# Altium project WaterNet23BotPCB.PrjPcb
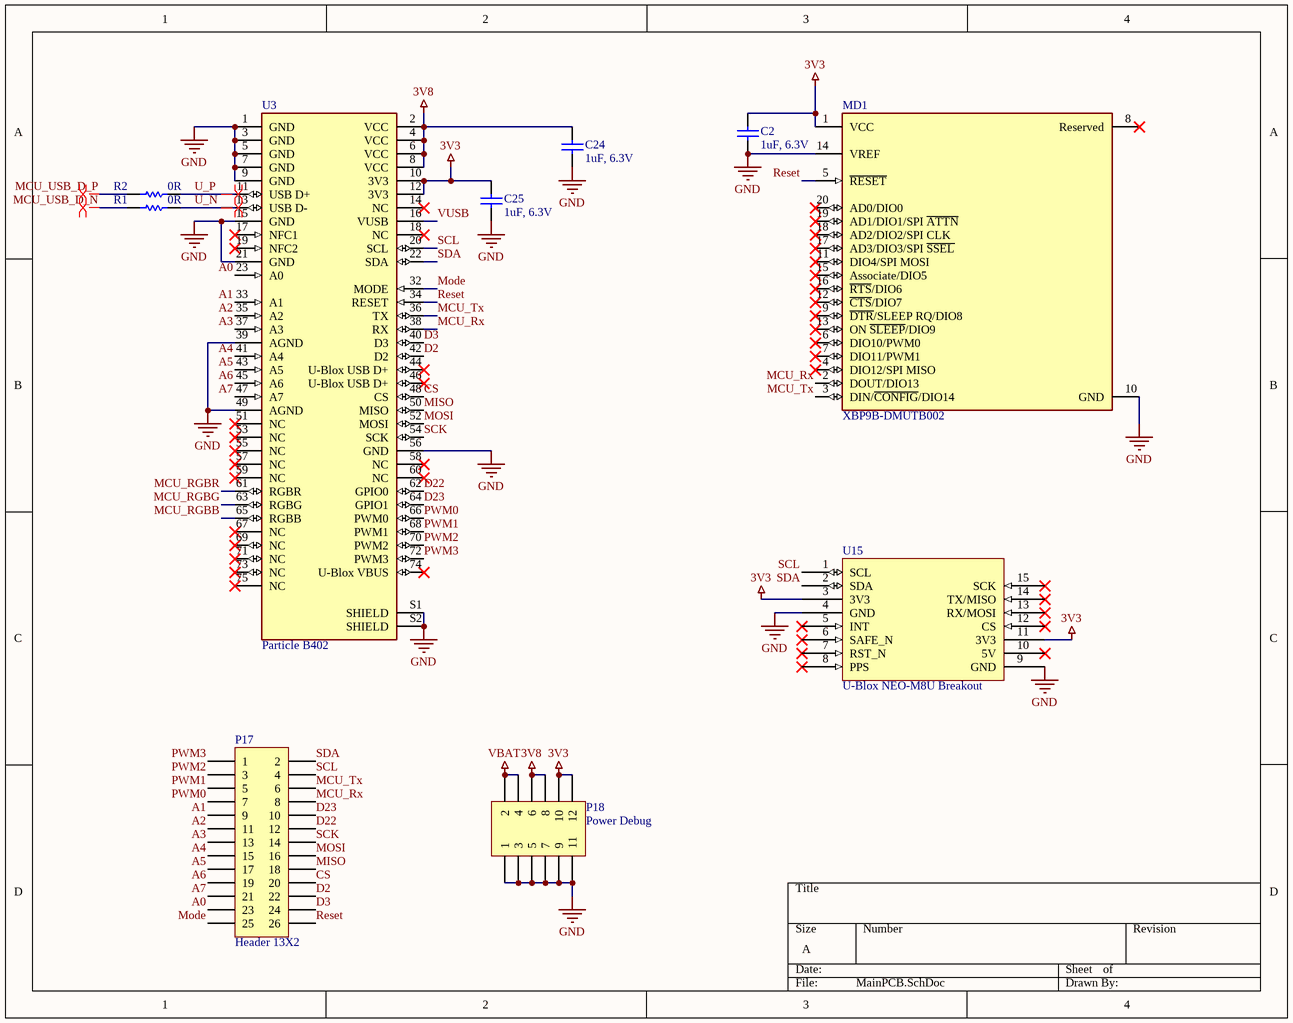
[diagram p0: MainPCB.SchDoc]
5 sheets, 153 parts. Net scope: global (net labels, ports and power ports of the same name join across sheets).
Board files: Main.PcbDoc, BetaPCB.PcbDoc
Sheets:
  MainPCB.SchDoc
  UserInputs.SchDoc
  Power.SchDoc
  LEDs.SchDoc
  Sensors.SchDoc

## Sheet MainPCB.SchDoc
size A; SheetNumber: 1; SheetTotal: 5

### Parts
C2  value 1uF, 6.3V  [ANTC1608X90N]  (hidden comment: Capacitor)
C24  value 1uF, 6.3V  [ANTC1608X90N]  (hidden comment: Capacitor)
C25  value 1uF, 6.3V  [ANTC1608X90N]  (hidden comment: Capacitor)
MD1  XBP9B-DMUTB002  [FP-XBP9B-DMUTB002-MFG]
P17  Header 13X2  [HDR2X13]
P18  Power Debug  [HDR2X6]
R1  value 0R  [0603 Resistor]  (hidden comment: Resistor)
R2  value 0R  [0603 Resistor]  (hidden comment: Resistor)
U3  Supplier Part Number 1: Particle B402  [B402 Full]  (hidden comment: B402)
U15  U-Blox NEO-M8U Breakout  [U-Blox NEO-M8U]

### Nets
3V3: C2.2 C25.2 MD1.1(VCC) P18.10 P18.12 U3.10(3V3) U3.12(3V3) U15.3(3V3) U15.11(3V3)
3V8: C24.2 P18.6 P18.8 U3.2(VCC) U3.4(VCC) U3.6(VCC) U3.8(VCC)
GND: C2.1 C24.1 C25.1 MD1.10(GND) MD1.14(VREF) P18.1 P18.3 P18.5 P18.7 P18.9 P18.11 U3.1(GND) U3.3(GND) U3.5(GND) U3.7(GND) U3.9(GND) U3.15(GND) U3.21(GND) U3.39(AGND) U3.49(AGND) U3.56(GND) U3.S1(SHIELD) U3.S2(SHIELD) U15.4(GND) U15.9(GND)
VBAT: P18.2 P18.4
A0: P17.23 U3.23(A0)
A1: P17.9 U3.33(A1)
A2: P17.11 U3.35(A2)
A3: P17.13 U3.37(A3)
A4: P17.15 U3.41(A4)
A5: P17.17 U3.43(A5)
A6: P17.19 U3.45(A6)
A7: P17.21 U3.47(A7)
CS: P17.20 U3.48(CS)
D2: P17.22 U3.42(D2)
D3: P17.24 U3.40(D3)
D22: P17.12 U3.62(GPIO0)
D23: P17.10 U3.64(GPIO1)
MCU_RGBB: U3.65(RGBB)
MCU_RGBG: U3.63(RGBG)
MCU_RGBR: U3.61(RGBR)
MCU_Rx: MD1.2(DOUT/DIO13) P17.8 U3.38(RX)
MCU_Tx: MD1.3(DIN/~{CONFIG}/DIO14) P17.6 U3.36(TX)
MCU_USB_D_N: R1.1
MCU_USB_D_P: R2.1
MISO: P17.18 U3.50(MISO)
Mode: P17.25 U3.32(MODE)
MOSI: P17.16 U3.52(MOSI)
PWM0: P17.7 U3.66(PWM0)
PWM1: P17.5 U3.68(PWM1)
PWM2: P17.3 U3.70(PWM2)
PWM3: P17.1 U3.72(PWM3)
Reset: MD1.5(~{RESET}) P17.26 U3.34(RESET)
SCK: P17.14 U3.54(SCK)
SCL: P17.4 U3.20(SCL) U15.1(SCL)
SDA: P17.2 U3.22(SDA) U15.2(SDA)
U_N: R1.2 U3.13(USB_D-)
U_P: R2.2 U3.11(USB_D+)
VUSB: U3.16(VUSB)

Not connected (* = marked no-connect by the designer): MD1 4(DIO12/SPI_MISO)* 6(DIO10/PWM0)* 7(DIO11/PWM1)* 8(Reserved)* 9(~{DTR}/SLEEP_RQ/DIO8)* 11(DIO4/SPI_MOSI)* 12(~{CTS}/DIO7)* 13(ON_~{SLEEP}/DIO9)* 15(Associate/DIO5)* 16(~{RTS}/DIO6)* 17(AD3/DIO3/SPI_~{SSEL})* 18(AD2/DIO2/SPI_CLK)* 19(AD1/DIO1/SPI_~{ATTN})* 20(AD0/DIO0)*; U3 14(NC)* 17(NFC1)* 18(NC)* 19(NFC2)* 44(U-Blox_USB_D+)* 46(U-Blox_USB_D+)* 51(NC)* 53(NC)* 55(NC)* 57(NC)* 58(NC)* 59(NC)* 60(NC)* 67(NC)* 69(NC)* 71(NC)* 73(NC)* 74(U-Blox_VBUS)* 75(NC)*; U15 5(INT)* 6(SAFE_N)* 7(RST_N)* 8(PPS)* 10(5V)* 12(CS)* 13(RX/MOSI)* 14(TX/MISO)* 15(SCK)*

### Layout directives
differential pair: MCU_USB_D_N, MCU_USB_D_P, U_N, U_P

### Library data of the parts
C2 C24 C25 = Capacitor: SimulationGenericComponent: True
MD1 = CMP-84319-000004-1: RX TXRX MOD ISM < 1GHZ U.FL TH; Max Supply Voltage: 3.6V; Current - Transmitting: 215mA; Sensitivity: -101dBm; Min Frequency: 902MHz; Memory Size: 2KB; Max Frequency: 928MHz; Min Supply Voltage: 2.4V; Current - Receiving: 29mA; Interface: SPI; Data Rate: 200Kbps; Frequency: 900MHz; Output Power (dBm): 24dBm; Number of Pins: 20; Series: XBee-Pro™; Max Operating Temperature: 85°C; Radiation Hardening: No; Min Operating Temperature: -40°C; Package Quantity: 1; RAM Size: 2KB; Packaging: Bulk; Case/Package: Module
P17 = Header 13X2: Header, 13-Pin, Dual row; LatestRevisionDate: 17-Jul-2002; LatestRevisionNote: Re-released for DXP Platform.; Publisher: Altium Limited
P18 = Header 6X2: Header, 6-Pin, Dual row; LatestRevisionDate: 17-Jul-2002; LatestRevisionNote: Re-released for DXP Platform.; Publisher: Altium Limited
R1 R2 = Resistor: TC1: 0; SimulationGenericComponent: True; TC2: 0
U3 = B402: Connector, Backplane, Housing, Receptacle, 67 Position, 2row; MP: 2199230-4; Package: None; Availability: Unavailable; Value: *; Price: None; Supplier 1: Digi-Key
U15 = U-Blox NEO-M8U Breakout: GPS Board

## Sheet UserInputs.SchDoc
size A; SheetNumber: 2; SheetTotal: 5
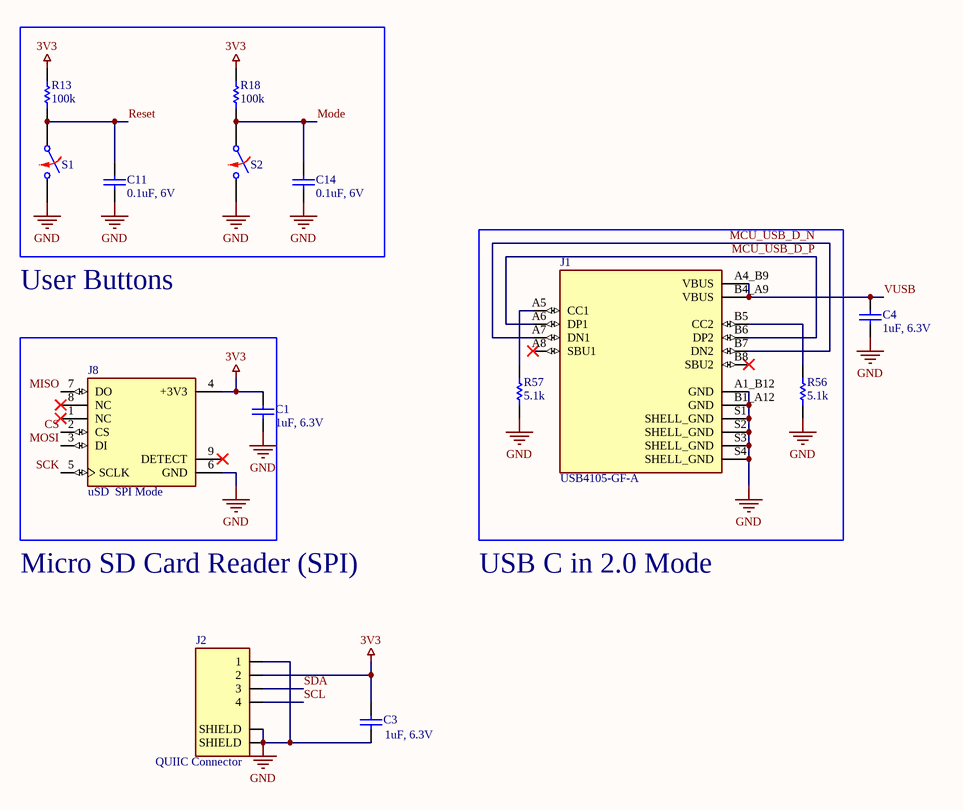
[diagram p1: UserInputs.SchDoc]

### Parts
C1  value 1uF, 6.3V  [ANTC1608X90N]  (hidden comment: Capacitor)
C3  value 1uF, 6.3V  [ANTC1608X90N]  (hidden comment: Capacitor)
C4  value 1uF, 6.3V  [ANTC1608X90N]  (hidden comment: Capacitor)
C11  value 0.1uF, 6V  [ANTC1608X90N]  (hidden comment: Capacitor)
C14  value 0.1uF, 6V  [ANTC1608X90N]  (hidden comment: Capacitor)
J1  USB4105-GF-A  [GCT_USB4105-GF-A]
J2  QUIIC Connector  [JST_SM04B-SRSS-TB(LF)(SN)]
J8  uSD  SPI Mode  [GCT_MEM2051-00-195-00-A]
R13  value 100k  [0603 Resistor]  (hidden comment: Resistor)
R18  value 100k  [0603 Resistor]  (hidden comment: Resistor)
R56  value 5.1k  [0603 Resistor]  (hidden comment: Resistor)
R57  value 5.1k  [0603 Resistor]  (hidden comment: Resistor)
S1  Switch Normally Opened  [TL3313AF250QG]  (value not drawn)
S2  Switch Normally Opened  [TL3313AF250QG]  (value not drawn)

### Nets
3V3: C1.2 C3.2 J2.2 J8.4(+3V3) R13.2 R18.2
GND: C1.1 C3.1 C4.1 C11.1 C14.1 J1.A1_B12(GND) J1.B1_A12(GND) J1.S1(SHELL_GND) J1.S2(SHELL_GND) J1.S3(SHELL_GND) J1.S4(SHELL_GND) J2.1 J2.S1(SHIELD) J2.S2(SHIELD) J8.6(GND) R56.1 R57.1 S1.2 S2.2
CS: J8.2(CS)
MCU_USB_D_N: J1.A7(DN1) J1.B7(DN2)
MCU_USB_D_P: J1.A6(DP1) J1.B6(DP2)
MISO: J8.7(DO)
Mode: C14.2 R18.1 S2.1
MOSI: J8.3(DI)
Reset: C11.2 R13.1 S1.1
SCK: J8.5(SCLK)
SCL: J2.4
SDA: J2.3
VUSB: C4.2 J1.A4_B9(VBUS) J1.B4_A9(VBUS)
NetJ1_A5: J1.A5(CC1) R57.2
NetJ1_B5: J1.B5(CC2) R56.2

Not connected (* = marked no-connect by the designer): J1 A8(SBU1)* B8(SBU2)*; J8 1(NC)* 8(NC)* 9(DETECT)*

### Notes on the sheet
- User Buttons
- Micro SD Card Reader (SPI)
- USB C in 2.0 Mode

### Library data of the parts
C1 C3 C4 C11 C14 = Capacitor: SimulationGenericComponent: True
J1 = USB4105-GF-A: USB-C (USB TYPE-C) USB 2.0 Receptacle Connector 24 (16+8 Dummy) Position Surface Mount, Right Angle; Through Hole; Value: *; Availability: Unavailable; Price: None; Package: None; MP: USB4105-GF-A
J2 = SM04B-SRSS-TB(LF)(SN): SH Series 1.0 mm Pitch 2 Position Single Row Side Entry Shrouded Header; Value: *; Availability: Unavailable; Price: None; Package: None; MP: SM04B-SRSS-TB(LF)(SN)
J8 = MEM2051-00-195-00-A: 9 (8 + 1) Position Card Connector microSDâ„¢ Surface Mount, Right Angle Gold, 1.95mm profile, Normally open switch, Push push, Top mount; MF: Global Connector Technology; Purchase-URL: https://pricing.snapeda.com/search/part/MEM2051-00-195-00-A/?ref=eda; Price: None; SnapEDA_Link: https://www.snapeda.com/parts/MEM2051-00-195-00-A/Global%20Connector%20Technology/view-part/779220/?ref=snap; Check_prices: https://www.snapeda.com/parts/MEM2051-00-195-00-A/Global%20Connector%20Technology/view-part/779220/?ref=eda; Package: None; MP: MEM2051-00-195-00-A; Value: *; Availability: Warning
R13 R18 R56 R57 = Resistor: TC1: 0; SimulationGenericComponent: True; TC2: 0
S1 S2 = SW NO: closed: 0; Rclosed: 1m; Ropen: 1Meg; SimulationGenericComponent: True

## Sheet Power.SchDoc
size 420 x 297 mm; SheetNumber: 3; SheetTotal: 5; SPICEModelCacheCTWGKBXG: <root> / <DocumentId>CTWGKBXG</DocumentId> / <CacheFrame Number="0"> / <Model Name="nmos" Kind="MDL"> / <Text>*Default N-Channel MOSFET / *Pinout: D,G,S / .MODEL NMOS NMOS()</Text> / </Model> / </CacheFrame> / </root>
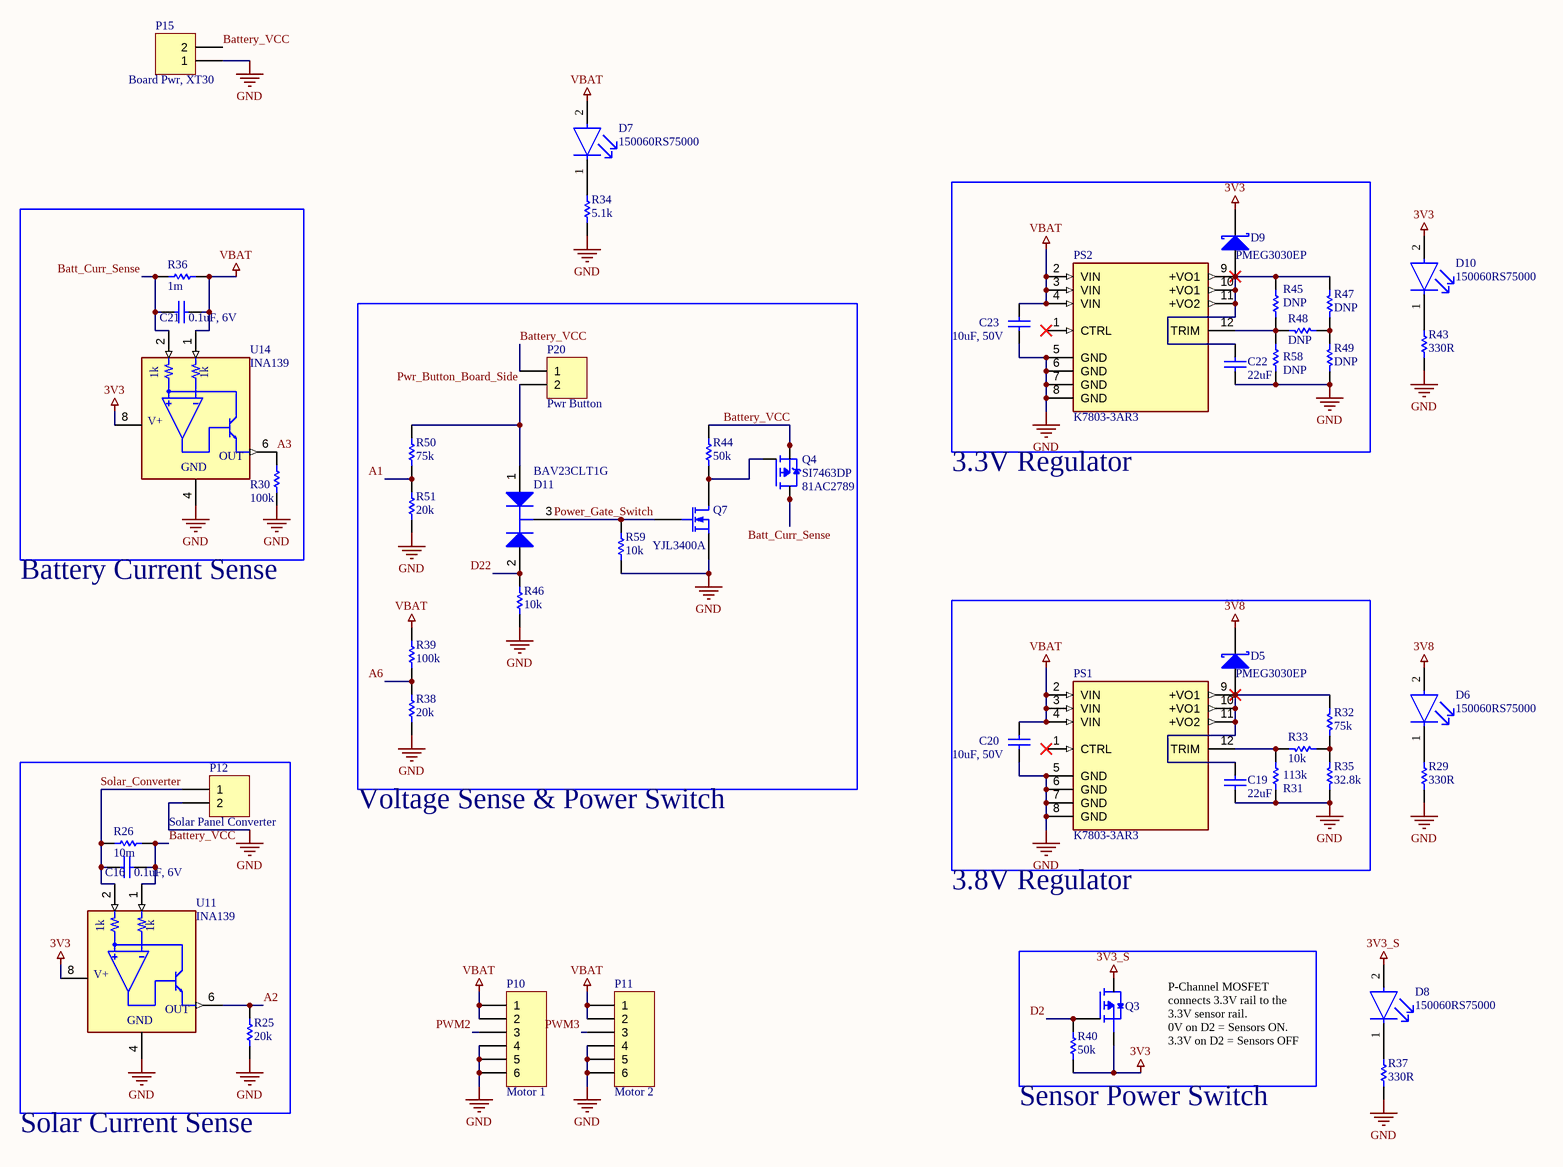
[diagram p2: Power.SchDoc]

### Parts
C16  value 0.1uF, 6V  [ANTC1608X90N]  (hidden comment: Capacitor)
C19  value 22uF  [ANTC1608X90N]  (hidden comment: Capacitor)
C20  value 10uF, 50V  [CAPC2012X145N]  (hidden comment: Capacitor)
C21  value 0.1uF, 6V  [ANTC1608X90N]  (hidden comment: Capacitor)
C22  value 22uF  [ANTC1608X90N]  (hidden comment: Capacitor)
C23  value 10uF, 50V  [CAPC2012X145N]  (hidden comment: Capacitor)
D5  PMEG3030EP  [SODFL470X110-2N]
D6  150060RS75000  [FP-150060RS75000-MFG]
D7  150060RS75000  [FP-150060RS75000-MFG]
D8  150060RS75000  [FP-150060RS75000-MFG]
D9  PMEG3030EP  [SODFL470X110-2N]
D10  150060RS75000  [FP-150060RS75000-MFG]
D11  BAV23CLT1G  [ONSC-SOT-23-3-318-08_V]
P10  Motor 1  [TE_1586039-6]
P11  Motor 2  [TE_1586039-6]
P12  Solar Panel Converter  [XT30_Horizontal]
P15  Board Pwr, XT30  [XT30_Horizontal]
P20  Pwr Button  [TE_6-440054-2]
PS1  K7803-3AR3  [CONV_K7803-3AR3]
PS2  K7803-3AR3  [CONV_K7803-3AR3]
Q3  YJL3415A  [SOT23-3]  (value not drawn)
Q4  SI7463DP  Supplier Part Number 1: 81AC2789  [SIR165DP]
Q7  YJL3400A  [SOT23-3]
R25  value 20k  [0603 Resistor]  (hidden comment: Resistor)
R26  value 10m  [RESC6331X70N]  (hidden comment: Resistor)
R29  value 330R  [0603 Resistor]  (hidden comment: Resistor)
R30  value 100k  [0603 Resistor]  (hidden comment: Resistor)
R31  value 113k  [0603 Resistor]  (hidden comment: Resistor)
R32  value 75k  [0603 Resistor]  (hidden comment: Resistor)
R33  value 10k  [0603 Resistor]  (hidden comment: Resistor)
R34  value 5.1k  [0603 Resistor]  (hidden comment: Resistor)
R35  value 32.8k  [0603 Resistor]  (hidden comment: Resistor)
R36  value 1m  [RESC6331X70N]  (hidden comment: Resistor)
R37  value 330R  [0603 Resistor]  (hidden comment: Resistor)
R38  value 20k  [0603 Resistor]  (hidden comment: Resistor)
R39  value 100k  [0603 Resistor]  (hidden comment: Resistor)
R40  value 50k  [0603 Resistor]  (hidden comment: Resistor)
R43  value 330R  [0603 Resistor]  (hidden comment: Resistor)
R44  value 50k  [0603 Resistor]  (hidden comment: Resistor)
R45  value DNP  [0603 Resistor]  (hidden comment: Resistor)
R46  value 10k  [0603 Resistor]  (hidden comment: Resistor)
R47  value DNP  [0603 Resistor]  (hidden comment: Resistor)
R48  value DNP  [0603 Resistor]  (hidden comment: Resistor)
R49  value DNP  [0603 Resistor]  (hidden comment: Resistor)
R50  value 75k  [0603 Resistor]  (hidden comment: Resistor)
R51  value 20k  [0603 Resistor]  (hidden comment: Resistor)
R58  value DNP  [0603 Resistor]  (hidden comment: Resistor)
R59  value 10k  [0603 Resistor]  (hidden comment: Resistor)
U11  INA139  [INA139-Q1]
U14  INA139  [INA139-Q1]

### Nets
3V3: D9.2(K) D10.2(A) Q3.3(D) R40.1 U11.8(V+) U14.8(V+)
3V3_S: D8.2(A) Q3.2(S)
3V8: D5.2(K) D6.2(A)
GND: C19.1 C20.1 C22.1 C23.1 P10.4 P10.5 P10.6 P11.4 P11.5 P11.6 P12.2 P15.1 PS1.5(GND) PS1.6(GND) PS1.7(GND) PS1.8(GND) PS2.5(GND) PS2.6(GND) PS2.7(GND) PS2.8(GND) Q7.2(S) R25.1 R29.2 R30.1 R31.1 R34.2 R35.1 R37.2 R38.1 R43.2 R46.1 R49.1 R51.1 R58.1 R59.1 U11.4(GND) U14.4(GND)
VBAT: C20.2 C21.1 C23.2 D7.2(A) P10.1 P10.2 P11.1 P11.2 PS1.2(VIN) PS1.3(VIN) PS1.4(VIN) PS2.2(VIN) PS2.3(VIN) PS2.4(VIN) R36.1 R39.2 U14.1(VIN-)
A1: R50.1 R51.2
A2: R25.2 U11.6(OUT)
A3: R30.2 U14.6(OUT)
A6: R38.2 R39.1
Batt_Curr_Sense: C21.2 Q4.5(D) Q4.6(D) Q4.7(D) Q4.8(D) Q4.9(D) R36.2 U14.2(VIN+)
Battery_VCC: C16.1 P15.2 P20.1 Q4.1(S) Q4.2(S) Q4.3(S) R26.2 R44.2 U11.1(VIN-)
D2: Q3.1(G) R40.2
D22: D11.2(A2) R46.2
Power_Gate_Switch: D11.3(K) Q7.1(G) R59.2
PWM2: P10.3
PWM3: P11.3
Pwr_Button_Board_Side: D11.1(A1) P20.2 R50.2
Solar_Converter: C16.2 P12.1 R26.1 U11.2(VIN+)
NetC19_2: C19.2 D5.1(A) PS1.9(+VO1) PS1.10(+VO1) PS1.11(+VO2) R32.2
NetC22_2: C22.2 D9.1(A) PS2.9(+VO1) PS2.10(+VO1) PS2.11(+VO2) R45.2 R47.2
NetD6_1: D6.1(C) R29.1
NetD7_1: D7.1(C) R34.1
NetD8_1: D8.1(C) R37.1
NetD10_1: D10.1(C) R43.1
NetPS1_12: PS1.12(TRIM) R31.2 R33.1
NetPS2_12: PS2.12(TRIM) R45.1 R48.1 R58.2
NetQ4_4: Q4.4(G) Q7.3(D) R44.1
NetR32_1: R32.1 R33.2 R35.2
NetR47_1: R47.1 R48.2 R49.2

Not connected (* = marked no-connect by the designer): PS1 1(CTRL)*; PS2 1(CTRL)*

### Notes on the sheet
- (near PS2) 3.3V Regulator
- Battery Current Sense
- Voltage Sense & Power Switch
- (near PS1) 3.8V Regulator
- P-Channel MOSFET connects 3.3V rail to the 3.3V sensor rail.               0V on D2 = Sensors ON.                             3.3V on D2 = Sensors OFF
- (near R40) Sensor Power Switch
- Solar Current Sense
- THIS DOCUMENT AND THE DATA DISCLOSED HEREIN OR
- HEREWITH IS THE PROPERTY OF ALTIUM LIMITED AND MAY
- DWG NO:
- REVISION
- REV:
- DESCRIPTION
- DATE
- APPROVED
- BE FREELY DISTRIBUTED IN WHOLE. NO RIGHTS ARE
- RESERVED OR EXPRESS OR IMPLIED WARANTEE GIVEN.
- ENG:
- APPROVALS
- PROJECT
- DSN:
- CHK:
- REFERENCE DOCUMENTS
- PROJECT REVISION:
- TITLE
- DOCUMENT REVISION:
- DESIGN ITEM:
- BOM:
- FAB DWG:
- PCB DWG:
- ASSY DWG:
- SCALE:
- A3
- SIZE
- CAGE CODE
- FILE NAME
- DWG NO.
- SHEET
- OF
- REV
- (in symbol INA139) 1k

### Library data of the parts
C16 C19-C23 = Capacitor: SimulationGenericComponent: True
D5 D9 = Shottky Diode: AF: 1; BV: 0; BV_MAX: 1e99; EG: 1.11; FC: 0.5; IBV: 0.001; IS: 1e-14; MJSW: 0.33; NTUN: 30; TNOM: 27; XTI: 3; SimulationGenericComponent: True; CJO: 0; CJP: 0; CTA: 0; CTP: 0; FCS: 0.5; FV_MAX: 1e99; IKF: 0; IKR: 0; ISR: 1e-14; JSW: 0; JTUN: 0; JTUNSW: 0; KEG: 1; KF: 0; LEVEL: 1; N: 1; NBV: 1; NR: 1; NS: 1; PHP: 1; RS: 0; TCV: 0; TLEV: 0; TLEVC: 0; TM1: 0; TM2: 0; TPB: 0; TPHP: 0; TRS: 0; TRS2: 0; TT: 0; TTT1: 0; TTT2: 0; VJ: 1; XTITUN: 3
D6-D8 D10 = CMP-1426-00001-2: LED RED CLEAR 0603 SMD; Luminous Intensity: 250mcd; Viewing Angle: 140°; Dominant Wavelength: 625nm; Test Current: 20mA; Forward Current: 30mA; Forward Voltage: 2V; Lens Color: Colorless; Lens Size: 0.7mm; Width: 0.8mm; Series: WL-SMCW; Color: Red; Min Operating Temperature: -40°C; RoHS Compliant: Yes; Height: 0.8mm; Package Quantity: 1; Packaging: Cut Tape; Mount: Surface Mount; Case/Package: 0603; Lens Transparency: Clear; Length: 1.6mm; Case Code (Imperial): 0603; Lens Style: Clear; Wavelength: 625nm; Max Operating Temperature: 85°C; Case Code (Metric): 1608
D11 = CMP-1054-00102-1: Dual High Voltage Common Cathode Switching Diodes, 3-Pin SOT-23, Pb-Free, Tape and Reel; Manufacturer: On Semiconductor; IF Max (A): 0.4; trr Max (ns): 150; ComponentLink1Description: Manufacturer URL; ComponentLink2URL: http://www.onsemi.com/pub_link/Collateral/BAV23CLT1-D.PDF; Packing: Tape and Reel; PackageReference: SOT-23-3-318-08; Configuration: Common Cathode; Mounting Technology: Surface Mount; DatasheetVersion: Rev. 2; ComponentLink3Description: Package Specification; PartNumber: BAV23CLT1G; ComponentLink1URL: http://www.onsemi.com/; PackageDescription: 3-Pin Small Outline Transistor, Body 2.92 x 1.3 mm, Pitch 0.95 mm; RoHS: TRUE; ComponentLink3URL: http://www.onsemi.cn/pub_link/Collateral/318-08.PDF; PackageVersion: Rev. AP, 11/2009; ComponentLink2Description: Datasheet
P10 P11 = Header 6: Header, 6-Pin; LatestRevisionDate: 17-Jul-2002; LatestRevisionNote: Re-released for DXP Platform.; Publisher: Altium Limited
P12 P15 P20 = Header 2: Header, 2-Pin; LatestRevisionDate: 17-Jul-2002; LatestRevisionNote: Re-released for DXP Platform.; Publisher: Altium Limited
PS1 PS2 = K7803-3AR3: Non-Isolated PoL Module DC DC Converter 1 Output 3.3V - - - 3A 8V - 36V Input; MF: Mornsun America, LLC; MP: K7803-3AR3; Purchase-URL: https://pricing.snapeda.com/search/part/K7803-3AR3/?ref=eda; SnapEDA_Link: https://www.snapeda.com/parts/K7803-3AR3/MORNSUN/view-part/?ref=snap; Check_prices: https://www.snapeda.com/parts/K7803-3AR3/MORNSUN/view-part/?ref=eda; Digi-Key_Part_Number: 2725-K7803-3AR3-ND; Package: SIP-12-12 MORNSUN; Value: *
Q3 = YJL3415A: P-Channel MOSFET
Q4 = SI7463DP: MOSFET P-CH 30V 60A PPAK SO-8; MF: Vishay; Check_prices: https://www.snapeda.com/parts/SI7463DP/Vishay/view-part/2773444/?ref=eda; Value: *; Purchase-URL: https://pricing.snapeda.com/search/part/SI7463DP/?ref=eda; Package: SO-8 Vishay; Price: None; MP: SI7463DP; Availability: In Stock; SnapEDA_Link: https://www.snapeda.com/parts/SI7463DP/Vishay/view-part/2773444/?ref=snap; Supplier 1: Newark
Q7 = MOSFET-N: N-Channel MOSFET; Published: 8-Jun-2000; LatestRevisionDate: 17-Jul-2002; LatestRevisionNote: Re-released for DXP Platform.; PackageVersion: 1995/1996; PackageReference: E3; Publisher: Altium Limited; PackageDescription: TO, Flat Index; 3 In-Line, Axial Leads; Body Dia. 4.6mm; Lead Dia. 0.5 mm (max)
R25 R26 R29-R40 R43-R51 R58 R59 = Resistor: TC1: 0; SimulationGenericComponent: True; TC2: 0
U11 U14 = INA139: Current Monitor Regulator High-Side SOT-23-5; MF: Texas Instruments; Package: SOT-23-5 Texas Instruments; Value: *; Availability: Unavailable; MP: INA139; SnapEDA_Link: https://www.snapeda.com/parts/INA139/Texas%20Instruments/view-part/560986/?ref=snap; Price: None

## Sheet LEDs.SchDoc
size A; SheetNumber: 4; SheetTotal: 5
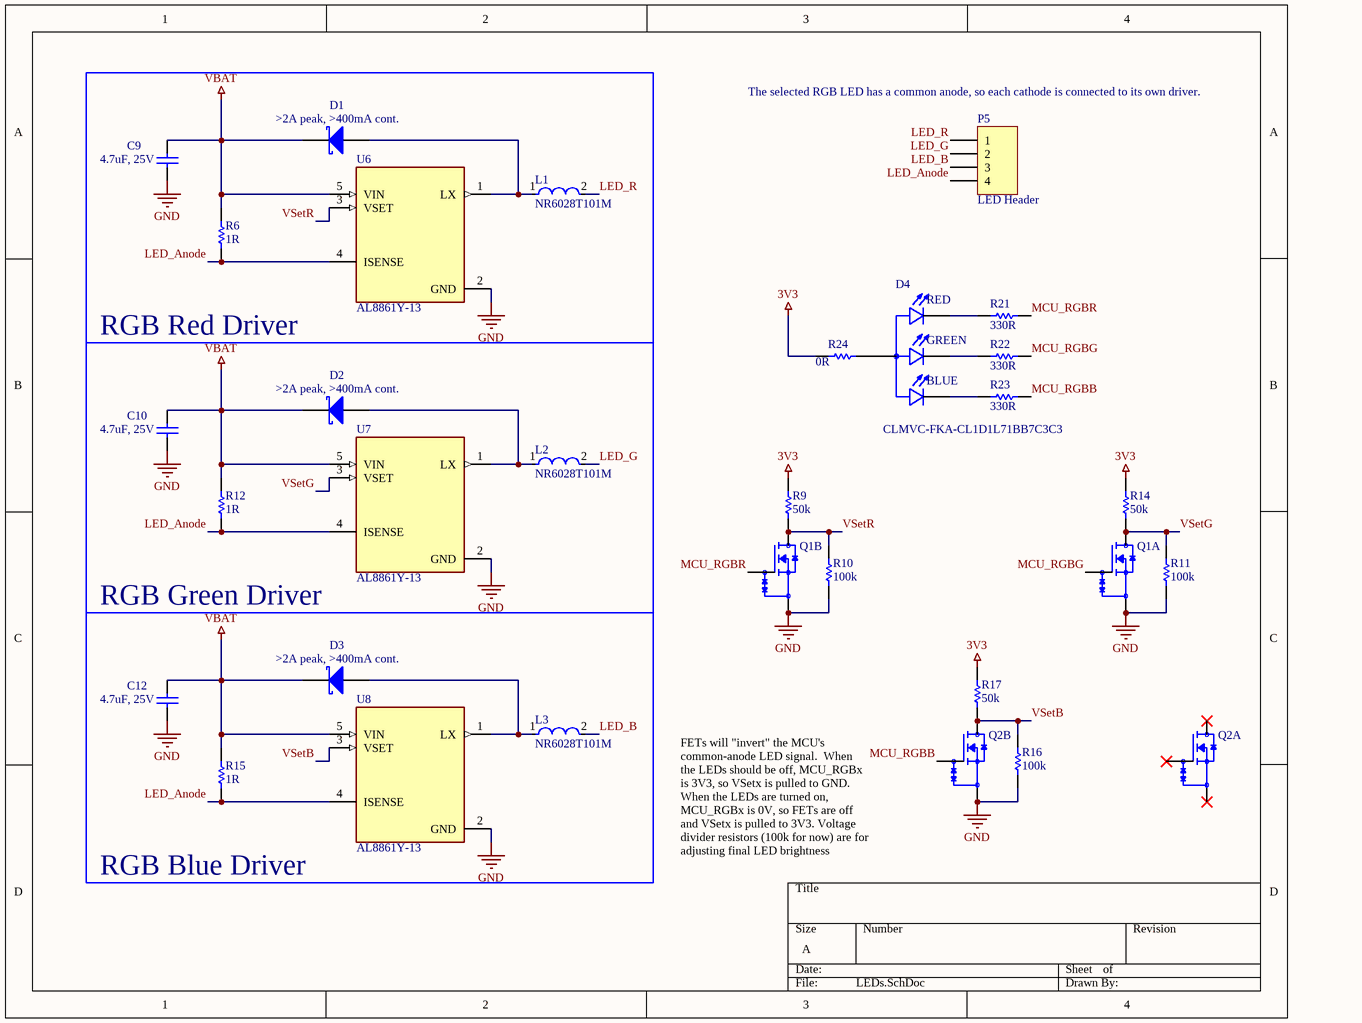
[diagram p3: LEDs.SchDoc]

### Parts
C9  value 4.7uF, 25V  [ANTC1608X90N]  (hidden comment: Capacitor)
C10  value 4.7uF, 25V  [ANTC1608X90N]  (hidden comment: Capacitor)
C12  value 4.7uF, 25V  [ANTC1608X90N]  (hidden comment: Capacitor)
D1  >2A peak, >400mA cont.  [DIO_SS26FL]
D2  >2A peak, >400mA cont.  [DIO_SS26FL]
D3  >2A peak, >400mA cont.  [DIO_SS26FL]
D4  CLMVC-FKA-CL1D1L71BB7C3C3  [LED_CLMVC-FKA-CL1D1L71BB7C3C3]
L1  NR6028T101M  [FP-NR6028-MFG]
L2  NR6028T101M  [FP-NR6028-MFG]
L3  NR6028T101M  [FP-NR6028-MFG]
P5  LED Header  [TE_350761-4]
Q1  TSM2N7002KDCU6_RFG  [SOT65P210X110-6N]  (value not drawn)  (parts A,B of 2)
Q2  TSM2N7002KDCU6_RFG  [SOT65P210X110-6N]  (value not drawn)  (parts A,B of 2)
R6  value 1R  [0603 Resistor]  (hidden comment: Resistor)
R9  value 50k  [0603 Resistor]  (hidden comment: Resistor)
R10  value 100k  [0603 Resistor]  (hidden comment: Resistor)
R11  value 100k  [0603 Resistor]  (hidden comment: Resistor)
R12  value 1R  [0603 Resistor]  (hidden comment: Resistor)
R14  value 50k  [0603 Resistor]  (hidden comment: Resistor)
R15  value 1R  [0603 Resistor]  (hidden comment: Resistor)
R16  value 100k  [0603 Resistor]  (hidden comment: Resistor)
R17  value 50k  [0603 Resistor]  (hidden comment: Resistor)
R21  value 330R  [0603 Resistor]  (hidden comment: Resistor)
R22  value 330R  [0603 Resistor]  (hidden comment: Resistor)
R23  value 330R  [0603 Resistor]  (hidden comment: Resistor)
R24  value 0R  [0603 Resistor]  (hidden comment: Resistor)
U6  AL8861Y-13  [CONV_AL8861Y-13]
U7  AL8861Y-13  [CONV_AL8861Y-13]
U8  AL8861Y-13  [CONV_AL8861Y-13]

### Blocks framed on the sheet
RGB Red Driver: C9 D1 L1 R6 U6
RGB Green Driver: C10 D2 L2 R12 U7
RGB Blue Driver: C12 D3 L3 R15 U8

### Nets
3V3: R9.2 R14.2 R17.2 R24.1
GND: C9.1 C10.1 C12.1 Q1.1(S1) Q1.4(S2) Q2.4(S2) R10.1 R11.1 R16.1 U6.2(GND) U7.2(GND) U8.2(GND)
VBAT: C9.2 C10.2 C12.2 D1.2(K) D2.2(K) D3.2(K) R6.1 R12.1 R15.1 U6.5(VIN) U7.5(VIN) U8.5(VIN)
LED_Anode: P5.4 R6.2 R12.2 R15.2 U6.4(ISENSE) U7.4(ISENSE) U8.4(ISENSE)
LED_B: L3.2 P5.3
LED_G: L2.2 P5.2
LED_R: L1.2 P5.1
MCU_RGBB: Q2.5(G2) R23.2
MCU_RGBG: Q1.2(G1) R22.2
MCU_RGBR: Q1.5(G2) R21.2
VSetB: Q2.3(D2) R16.2 R17.1 U8.3(VSET)
VSetG: Q1.6(D1) R11.2 R14.1 U7.3(VSET)
VSetR: Q1.3(D2) R9.1 R10.2 U6.3(VSET)
NetD1_1: D1.1(A) L1.1 U6.1(LX)
NetD2_1: D2.1(A) L2.1 U7.1(LX)
NetD3_1: D3.1(A) L3.1 U8.1(LX)
NetD4_1: D4.1(A) R24.2
NetD4_2: D4.2(B_C) R23.1
NetD4_3: D4.3(G_C) R22.1
NetD4_4: D4.4(R_C) R21.1

Not connected (* = marked no-connect by the designer): Q2 1(S1)* 2(G1)* 6(D1)*

### Notes on the sheet
- (near P5) The selected RGB LED has a common anode, so each cathode is connected to its own driver.
- FETs will "invert" the MCU's common-anode LED signal.  When the LEDs should be off, MCU_RGBx is 3V3, so VSetx is pulled to GND.  When the LEDs are turned on, MCU_RGBx is 0V, so FETs are off and VSetx is pulled to 3V3. Voltage divider resistors (100k for now) are for adjusting final LED brightness
- (in symbol CLMVC-FKA-CL1D1L71BB7C3C3) RED; GREEN; BLUE

### Library data of the parts
C9 C10 C12 = Capacitor: SimulationGenericComponent: True
D1-D3 = Shottky Diode: as D5 on sheet Power; CJO: 0; CJP: 0; CTA: 0; CTP: 0; FCS: 0.5; FV_MAX: 1e99; IKF: 0; IKR: 0; ISR: 1e-14; JSW: 0; JTUN: 0; JTUNSW: 0; KEG: 1; KF: 0; LEVEL: 1; N: 1; NBV: 1; NR: 1; NS: 1; PHP: 1; RS: 0; TCV: 0; TLEV: 0; TLEVC: 0; TM1: 0; TM2: 0; TPB: 0; TPHP: 0; TRS: 0; TRS2: 0; TT: 0; TTT1: 0; TTT2: 0; VJ: 1; XTITUN: 3
D4 = CLMVC-FKA-CL1D1L71BB7C3C3: Red, Green, Blue (RGB) 622nm Red, 530nm Green, 470nm Blue LED Indication - Discrete 2V Red, 3V Green, 3V Blue 4-SMD, J-Lead; MF: Cree Inc.; SnapEDA_Link: https://www.snapeda.com/parts/CLMVC-FKA-CL1D1L71BB7C3C3/Cree%20Inc./view-part/3120624/?ref=snap; Package: SMD-4 Cree Inc.; Check_prices: https://www.snapeda.com/parts/CLMVC-FKA-CL1D1L71BB7C3C3/Cree%20Inc./view-part/3120624/?ref=eda; MP: CLMVC-FKA-CL1D1L71BB7C3C3; Value: *; Purchase-URL: https://pricing.snapeda.com/search/part/CLMVC-FKA-CL1D1L71BB7C3C3/?ref=eda; Availability: Warning; Price: None
L1-L3 = CMP-14484-001005-1: SMD Power Inductors 100uH ±20% 0.62A 0.78Ω; Self Resonant Frequency: 3MHz; RMS Current (Irms): 660mA; Shielding: Shielded; Core Material: Ferrite; Test Frequency: 100kHz; DC Resistance (DCR): 780mR; Saturation Current: 620mA; Max Operating Temperature: 120°C; Halogen Free: Halogen Free; Tolerance: 20%; Number of Pins: 2; Resistor Type: Wirewound; Length: 0.236inch; Mount: Surface Mount; Case/Package: Nonstandard; RoHS Compliant: Yes; Inductance Tolerance: 20%; Lead Free: Lead Free; Max DC Current: 660mA; Height - Seated (Max): 0.11inch; Current Rating: 660mA; Packaging: Tape and Reel; Min Operating Temperature: -25°C; Inductance: 100uH; Termination: SMD/SMT; Height: 2.8mm; Package Quantity: 2000; Series: NR; Width: 0.236inch
P5 = Header 4: Header, 4-Pin; LatestRevisionDate: 17-Jul-2002; LatestRevisionNote: Re-released for DXP Platform.; Publisher: Altium Limited
Q1 Q2 = TSM2N7002KDCU6_RFG: 60V, 0.22A, Dual N-Channel Power MOSFET; MF: Taiwan Semiconductor; MP: TSM2N7002KDCU6 RFG; Value: *; Check_prices: https://www.snapeda.com/parts/TSM2N7002KDCU6%20RFG/Taiwan+Semiconductor/view-part/?ref=eda; Price: None; SnapEDA_Link: https://www.snapeda.com/parts/TSM2N7002KDCU6%20RFG/Taiwan+Semiconductor/view-part/?ref=snap; Availability: In Stock; Package: None
R6 R9-R12 R14-R17 R21-R24 = Resistor: TC1: 0; SimulationGenericComponent: True; TC2: 0
U6-U8 = AL8861Y-13: LED Driver IC 1 Output DC DC Regulator Step-Down _Buck_ Analog, PWM Dimming 1.5A SOT-89-5; MF: Diodes Inc.; Availability: Unavailable; SnapEDA_Link: https://www.snapeda.com/parts/AL8861Y-13/Diodes%20Inc./view-part/1241445/?ref=snap; MP: AL8861Y-13; Price: None; Package: SOT-89 Diodes Inc.; Value: *

## Sheet Sensors.SchDoc
size 431 x 279 mm; SheetNumber: 5; SheetTotal: 5; SPICEModelCacheYBELZEHK: <root> / <DocumentId>YBELZEHK</DocumentId> / <CacheFrame Number="0"> / <Model Name="nmos" Kind="MDL"> / <Text>*Default N-Channel MOSFET / *Pinout: D,G,S / .MODEL NMOS NMOS()</Text> / </Model> / </CacheFrame> / </root>
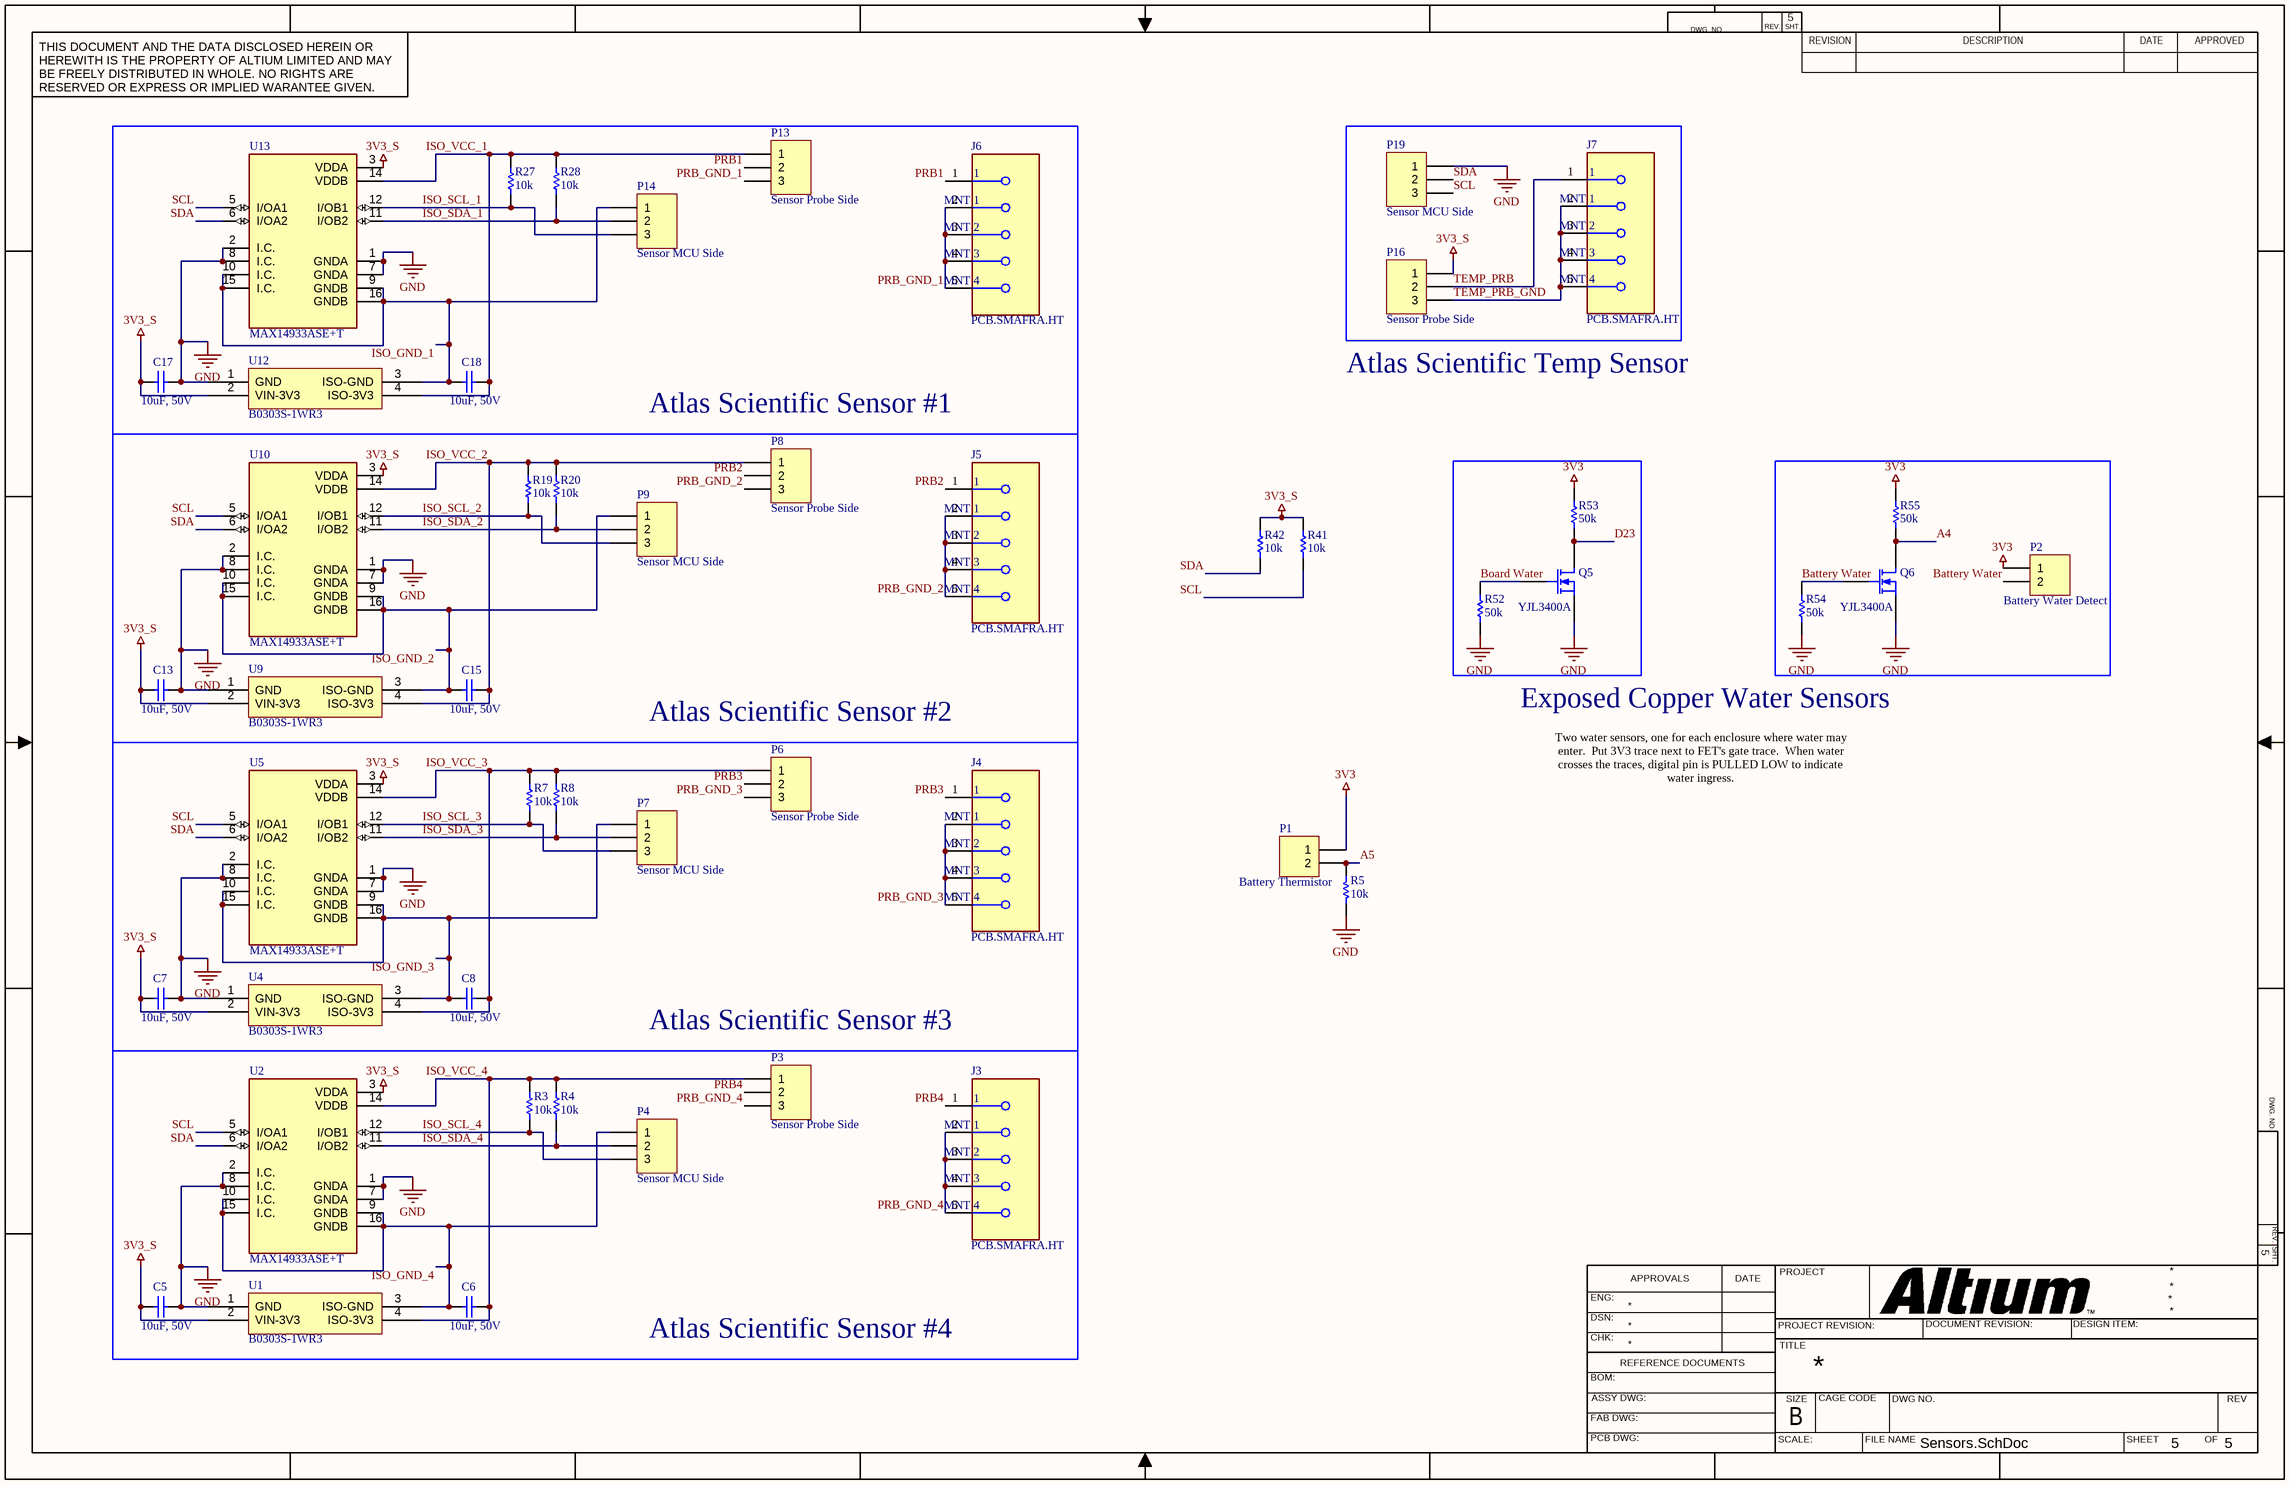
[diagram p4: Sensors.SchDoc]

### Parts
C5  value 10uF, 50V  [CAPC2012X145N]  (hidden comment: Capacitor)
C6  value 10uF, 50V  [CAPC2012X145N]  (hidden comment: Capacitor)
C7  value 10uF, 50V  [CAPC2012X145N]  (hidden comment: Capacitor)
C8  value 10uF, 50V  [CAPC2012X145N]  (hidden comment: Capacitor)
C13  value 10uF, 50V  [CAPC2012X145N]  (hidden comment: Capacitor)
C15  value 10uF, 50V  [CAPC2012X145N]  (hidden comment: Capacitor)
C17  value 10uF, 50V  [CAPC2012X145N]  (hidden comment: Capacitor)
C18  value 10uF, 50V  [CAPC2012X145N]  (hidden comment: Capacitor)
J3  PCB.SMAFRA.HT  [FP-PCB_SMAFRA_HT-MFG]
J4  PCB.SMAFRA.HT  [FP-PCB_SMAFRA_HT-MFG]
J5  PCB.SMAFRA.HT  [FP-PCB_SMAFRA_HT-MFG]
J6  PCB.SMAFRA.HT  [FP-PCB_SMAFRA_HT-MFG]
J7  PCB.SMAFRA.HT  [FP-PCB_SMAFRA_HT-MFG]
P1  Battery Thermistor  [TE_6-440054-2]
P2  Battery Water Detect  [TE_6-440054-2]
P3  Sensor Probe Side  [1x3 Header]
P4  Sensor MCU Side  [1x3 Header]
P6  Sensor Probe Side  [1x3 Header]
P7  Sensor MCU Side  [1x3 Header]
P8  Sensor Probe Side  [1x3 Header]
P9  Sensor MCU Side  [1x3 Header]
P13  Sensor Probe Side  [1x3 Header]
P14  Sensor MCU Side  [1x3 Header]
P16  Sensor Probe Side  [1x3 Header]
P19  Sensor MCU Side  [1x3 Header]
Q5  YJL3400A  [SOT23-3]
Q6  YJL3400A  [SOT23-3]
R3  value 10k  [0603 Resistor]  (hidden comment: Resistor)
R4  value 10k  [0603 Resistor]  (hidden comment: Resistor)
R5  value 10k  [0603 Resistor]  (hidden comment: Resistor)
R7  value 10k  [0603 Resistor]  (hidden comment: Resistor)
R8  value 10k  [0603 Resistor]  (hidden comment: Resistor)
R19  value 10k  [0603 Resistor]  (hidden comment: Resistor)
R20  value 10k  [0603 Resistor]  (hidden comment: Resistor)
R27  value 10k  [0603 Resistor]  (hidden comment: Resistor)
R28  value 10k  [0603 Resistor]  (hidden comment: Resistor)
R41  value 10k  [0603 Resistor]  (hidden comment: Resistor)
R42  value 10k  [0603 Resistor]  (hidden comment: Resistor)
R52  value 50k  [0603 Resistor]  (hidden comment: Resistor)
R53  value 50k  [0603 Resistor]  (hidden comment: Resistor)
R54  value 50k  [0603 Resistor]  (hidden comment: Resistor)
R55  value 50k  [0603 Resistor]  (hidden comment: Resistor)
U1  B0303S-1WR3  [B0303S-1WR3]
U2  MAX14933ASE+T  [SOIC127P600X175-16N]
U4  B0303S-1WR3  [B0303S-1WR3]
U5  MAX14933ASE+T  [SOIC127P600X175-16N]
U9  B0303S-1WR3  [B0303S-1WR3]
U10  MAX14933ASE+T  [SOIC127P600X175-16N]
U12  B0303S-1WR3  [B0303S-1WR3]
U13  MAX14933ASE+T  [SOIC127P600X175-16N]

### Blocks framed on the sheet
Atlas Scientific Sensor #1: C17 C18 J6 P13 P14 R27 R28 U12 U13
Atlas Scientific Sensor #2: C13 C15 J5 P8 P9 R19 R20 U9 U10
Atlas Scientific Sensor #3: C7 C8 J4 P6 P7 R7 R8 U4 U5
Atlas Scientific Sensor #4: C5 C6 J3 P3 P4 R3 R4 U1 U2

### Nets
3V3: P1.1 P2.1 R53.2 R55.2
3V3_S: C5.1 C7.1 C13.1 C17.1 P16.1 R41.2 R42.2 U1.2(VIN-3V3) U2.3(VDDA) U4.2(VIN-3V3) U5.3(VDDA) U9.2(VIN-3V3) U10.3(VDDA) U12.2(VIN-3V3) U13.3(VDDA)
GND: C5.2 C7.2 C13.2 C17.2 P19.1 Q5.2(S) Q6.2(S) R5.1 R52.1 R54.1 U1.1(GND) U2.1(GNDA) U2.2(I.C.) U2.7(GNDA) U2.8(I.C.) U4.1(GND) U5.1(GNDA) U5.2(I.C.) U5.7(GNDA) U5.8(I.C.) U9.1(GND) U10.1(GNDA) U10.2(I.C.) U10.7(GNDA) U10.8(I.C.) U12.1(GND) U13.1(GNDA) U13.2(I.C.) U13.7(GNDA) U13.8(I.C.)
A4: Q6.3(D) R55.1
A5: P1.2 R5.2
Battery Water: P2.2 Q6.1(G) R54.2
Board Water: Q5.1(G) R52.2
D23: Q5.3(D) R53.1
ISO_GND_1: C18.1 P14.1 U12.3(ISO-GND) U13.9(GNDB) U13.10(I.C.) U13.15(I.C.) U13.16(GNDB)
ISO_GND_2: C15.1 P9.1 U9.3(ISO-GND) U10.9(GNDB) U10.10(I.C.) U10.15(I.C.) U10.16(GNDB)
ISO_GND_3: C8.1 P7.1 U4.3(ISO-GND) U5.9(GNDB) U5.10(I.C.) U5.15(I.C.) U5.16(GNDB)
ISO_GND_4: C6.1 P4.1 U1.3(ISO-GND) U2.9(GNDB) U2.10(I.C.) U2.15(I.C.) U2.16(GNDB)
ISO_SCL_1: P14.3 R27.1 U13.12(I/OB1)
ISO_SCL_2: P9.3 R19.1 U10.12(I/OB1)
ISO_SCL_3: P7.3 R7.1 U5.12(I/OB1)
ISO_SCL_4: P4.3 R3.1 U2.12(I/OB1)
ISO_SDA_1: P14.2 R28.1 U13.11(I/OB2)
ISO_SDA_2: P9.2 R20.1 U10.11(I/OB2)
ISO_SDA_3: P7.2 R8.1 U5.11(I/OB2)
ISO_SDA_4: P4.2 R4.1 U2.11(I/OB2)
ISO_VCC_1: C18.2 P13.1 R27.2 R28.2 U12.4(ISO-3V3) U13.14(VDDB)
ISO_VCC_2: C15.2 P8.1 R19.2 R20.2 U9.4(ISO-3V3) U10.14(VDDB)
ISO_VCC_3: C8.2 P6.1 R7.2 R8.2 U4.4(ISO-3V3) U5.14(VDDB)
ISO_VCC_4: C6.2 P3.1 R3.2 R4.2 U1.4(ISO-3V3) U2.14(VDDB)
PRB1: J6.1 P13.2
PRB2: J5.1 P8.2
PRB3: J4.1 P6.2
PRB4: J3.1 P3.2
PRB_GND_1: J6.2(MNT_1) J6.3(MNT_2) J6.4(MNT_3) J6.5(MNT_4) P13.3
PRB_GND_2: J5.2(MNT_1) J5.3(MNT_2) J5.4(MNT_3) J5.5(MNT_4) P8.3
PRB_GND_3: J4.2(MNT_1) J4.3(MNT_2) J4.4(MNT_3) J4.5(MNT_4) P6.3
PRB_GND_4: J3.2(MNT_1) J3.3(MNT_2) J3.4(MNT_3) J3.5(MNT_4) P3.3
SCL: P19.3 R41.1 U2.5(I/OA1) U5.5(I/OA1) U10.5(I/OA1) U13.5(I/OA1)
SDA: P19.2 R42.1 U2.6(I/OA2) U5.6(I/OA2) U10.6(I/OA2) U13.6(I/OA2)
TEMP_PRB: J7.1 P16.2
TEMP_PRB_GND: J7.2(MNT_1) J7.3(MNT_2) J7.4(MNT_3) J7.5(MNT_4) P16.3

### Notes on the sheet
- Atlas Scientific Temp Sensor
- Exposed Copper Water Sensors
- Two water sensors, one for each enclosure where water may enter.  Put 3V3 trace next to FET's gate trace.  When water crosses the traces, digital pin is PULLED LOW to indicate water ingress.
- DWG. NO.
- REV.
- SHT.
- THIS DOCUMENT AND THE DATA DISCLOSED HEREIN OR HEREWITH IS THE PROPERTY OF ALTIUM LIMITED AND MAY BE FREELY DISTRIBUTED IN WHOLE. NO RIGHTS ARE RESERVED OR EXPRESS OR IMPLIED WARANTEE GIVEN.
- REVISION
- DESCRIPTION
- DATE
- APPROVED
- ENG:
- APPROVALS
- PROJECT
- DSN:
- CHK:
- REFERENCE DOCUMENTS
- PROJECT REVISION:
- TITLE
- DOCUMENT REVISION:
- DESIGN ITEM:
- BOM:
- FAB DWG:
- PCB DWG:
- ASSY DWG:
- SCALE:
- SIZE
- B
- CAGE CODE
- FILE NAME
- DWG NO.
- SHEET
- OF
- REV

### Library data of the parts
C5-C8 C13 C15 C17 C18 = Capacitor: SimulationGenericComponent: True
J3-J7 = CMP-111093-000003-1: CONN SMA JACK R/A 50OHM PCB; Dielectric Material: PTFE; Max Frequency: 6GHz; Body Material: Brass; Center Contact Plating: Gold; Voltage Rating: 500V; Operating Frequency: 0 to 6 GHz; Number of Ports: 1; Impedance: 50R; Housing Color: Gold; Mount: Through Hole; Orientation: Right Angle; Termination: Solder; Contact Material: Brass; Series: -; Contact Plating: Gold; Fastening Type: Threaded; Connector Type: SMA; Package Quantity: 500; Case/Package: SMA; Body Plating: Gold; Frequency: 6GHz; Packaging: Tray
P1 P2 = Header 2: Header, 2-Pin; LatestRevisionDate: 17-Jul-2002; LatestRevisionNote: Re-released for DXP Platform.; Publisher: Altium Limited
P3 P4 P6-P9 P13 P14 P16 P19 = Header 3: Header, 3-Pin; LatestRevisionDate: 17-Jul-2002; LatestRevisionNote: Re-released for DXP Platform.; Publisher: Altium Limited
Q5 Q6 = MOSFET-N: N-Channel MOSFET; Published: 8-Jun-2000; LatestRevisionDate: 17-Jul-2002; LatestRevisionNote: Re-released for DXP Platform.; PackageVersion: 1995/1996; PackageReference: E3; Publisher: Altium Limited; PackageDescription: TO, Flat Index; 3 In-Line, Axial Leads; Body Dia. 4.6mm; Lead Dia. 0.5 mm (max)
R3-R5 R7 R8 R19 R20 R27 R28 R41 R42 R52-R55 = Resistor: TC1: 0; SimulationGenericComponent: True; TC2: 0
U1 U4 U9 U12 = B0303S-1WR3: 3V3 Isolator
U2 U5 U10 U13 = MAX14933ASE+T: Package: None; Price: None; Value: *; MP: MAX14933ASE+T; Availability: Unavailable

## Nets that join several sheets
3V3: MainPCB (9 pins), UserInputs (6 pins), Power (6 pins), LEDs (R9.2 R14.2 R17.2 R24.1), Sensors (P1.1 P2.1 R53.2 R55.2)
3V3_S: Power (D8.2 Q3.2), Sensors (15 pins)
3V8: MainPCB (7 pins), Power (D5.2 D6.2)
GND: MainPCB (25 pins), UserInputs (19 pins), Power (37 pins), LEDs (12 pins), Sensors (30 pins)
VBAT: MainPCB (P18.2 P18.4), Power (17 pins), LEDs (12 pins)
A1: MainPCB (P17.9 U3.33), Power (R50.1 R51.2)
A2: MainPCB (P17.11 U3.35), Power (R25.2 U11.6)
A3: MainPCB (P17.13 U3.37), Power (R30.2 U14.6)
A4: MainPCB (P17.15 U3.41), Sensors (Q6.3 R55.1)
A5: MainPCB (P17.17 U3.43), Sensors (P1.2 R5.2)
A6: MainPCB (P17.19 U3.45), Power (R38.2 R39.1)
CS: MainPCB (P17.20 U3.48), UserInputs (J8.2)
D2: MainPCB (P17.22 U3.42), Power (Q3.1 R40.2)
D22: MainPCB (P17.12 U3.62), Power (D11.2 R46.2)
D23: MainPCB (P17.10 U3.64), Sensors (Q5.3 R53.1)
MCU_RGBB: MainPCB (U3.65), LEDs (Q2.5 R23.2)
MCU_RGBG: MainPCB (U3.63), LEDs (Q1.2 R22.2)
MCU_RGBR: MainPCB (U3.61), LEDs (Q1.5 R21.2)
MCU_USB_D_N: MainPCB (R1.1), UserInputs (J1.A7 J1.B7)
MCU_USB_D_P: MainPCB (R2.1), UserInputs (J1.A6 J1.B6)
MISO: MainPCB (P17.18 U3.50), UserInputs (J8.7)
Mode: MainPCB (P17.25 U3.32), UserInputs (C14.2 R18.1 S2.1)
MOSI: MainPCB (P17.16 U3.52), UserInputs (J8.3)
PWM2: MainPCB (P17.3 U3.70), Power (P10.3)
PWM3: MainPCB (P17.1 U3.72), Power (P11.3)
Reset: MainPCB (MD1.5 P17.26 U3.34), UserInputs (C11.2 R13.1 S1.1)
SCK: MainPCB (P17.14 U3.54), UserInputs (J8.5)
SCL: MainPCB (P17.4 U3.20 U15.1), UserInputs (J2.4), Sensors (6 pins)
SDA: MainPCB (P17.2 U3.22 U15.2), UserInputs (J2.3), Sensors (6 pins)
VUSB: MainPCB (U3.16), UserInputs (C4.2 J1.A4_B9 J1.B4_A9)